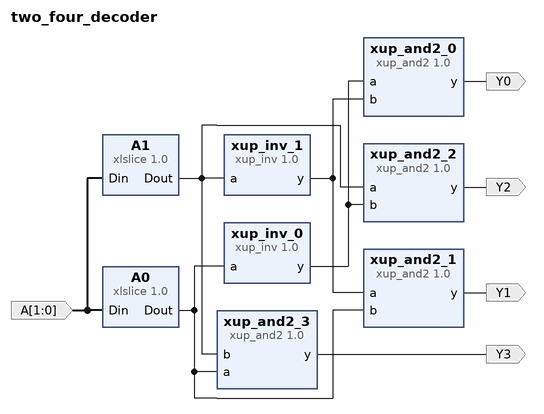
[diagram p0: block diagram of the top level]
# Vivado block design two_four_decoder, xc7a35tcpg236-1, Vivado 2016.3
create_bd_design two_four_decoder

create_bd_port -dir I -from 1 -to 0 A
create_bd_port -dir O Y3
create_bd_port -dir O Y2
create_bd_port -dir O Y1
create_bd_port -dir O Y0

create_bd_cell -type ip -vlnv xilinx.com:ip:xlslice:1.0 A0
set_property -dict {CONFIG.DOUT_WIDTH 1 CONFIG.DIN_TO 0 CONFIG.DIN_FROM 0 CONFIG.DIN_WIDTH 2} [get_bd_cells A0]
create_bd_cell -type ip -vlnv xilinx.com:ip:xlslice:1.0 A1
set_property -dict {CONFIG.DOUT_WIDTH 1 CONFIG.DIN_TO 1 CONFIG.DIN_FROM 1 CONFIG.DIN_WIDTH 2} [get_bd_cells A1]
create_bd_cell -type ip -vlnv xilinx.com:xup:xup_inv:1.0 xup_inv_0
create_bd_cell -type ip -vlnv xilinx.com:xup:xup_inv:1.0 xup_inv_1
create_bd_cell -type ip -vlnv xilinx.com:xup:xup_and2:1.0 xup_and2_0
create_bd_cell -type ip -vlnv xilinx.com:xup:xup_and2:1.0 xup_and2_1
create_bd_cell -type ip -vlnv xilinx.com:xup:xup_and2:1.0 xup_and2_2
create_bd_cell -type ip -vlnv xilinx.com:xup:xup_and2:1.0 xup_and2_3

# ---- connections ----

connect_bd_net [get_bd_ports A] [get_bd_pins A0/Din] [get_bd_pins A1/Din]
connect_bd_net [get_bd_pins A1/Dout] [get_bd_pins xup_inv_1/a] [get_bd_pins xup_and2_3/b] [get_bd_pins xup_and2_2/a]
connect_bd_net [get_bd_pins A0/Dout] [get_bd_pins xup_inv_0/a] [get_bd_pins xup_and2_3/a] [get_bd_pins xup_and2_1/b]
connect_bd_net [get_bd_pins xup_and2_3/y] [get_bd_ports Y3]
connect_bd_net [get_bd_pins xup_inv_0/y] [get_bd_pins xup_and2_2/b] [get_bd_pins xup_and2_0/a]
connect_bd_net [get_bd_pins xup_and2_2/y] [get_bd_ports Y2]
connect_bd_net [get_bd_pins xup_inv_1/y] [get_bd_pins xup_and2_1/a] [get_bd_pins xup_and2_0/b]
connect_bd_net [get_bd_pins xup_and2_1/y] [get_bd_ports Y1]
connect_bd_net [get_bd_pins xup_and2_0/y] [get_bd_ports Y0]

validate_bd_design
save_bd_design
